# Altium schematic sheet M1-Test-Board.SchDoc: M1 Test Fixture Custom Board
size OrCAD B; Author: Leo Buchman; Revision: 1; SheetNumber: 1; SheetTotal: 2
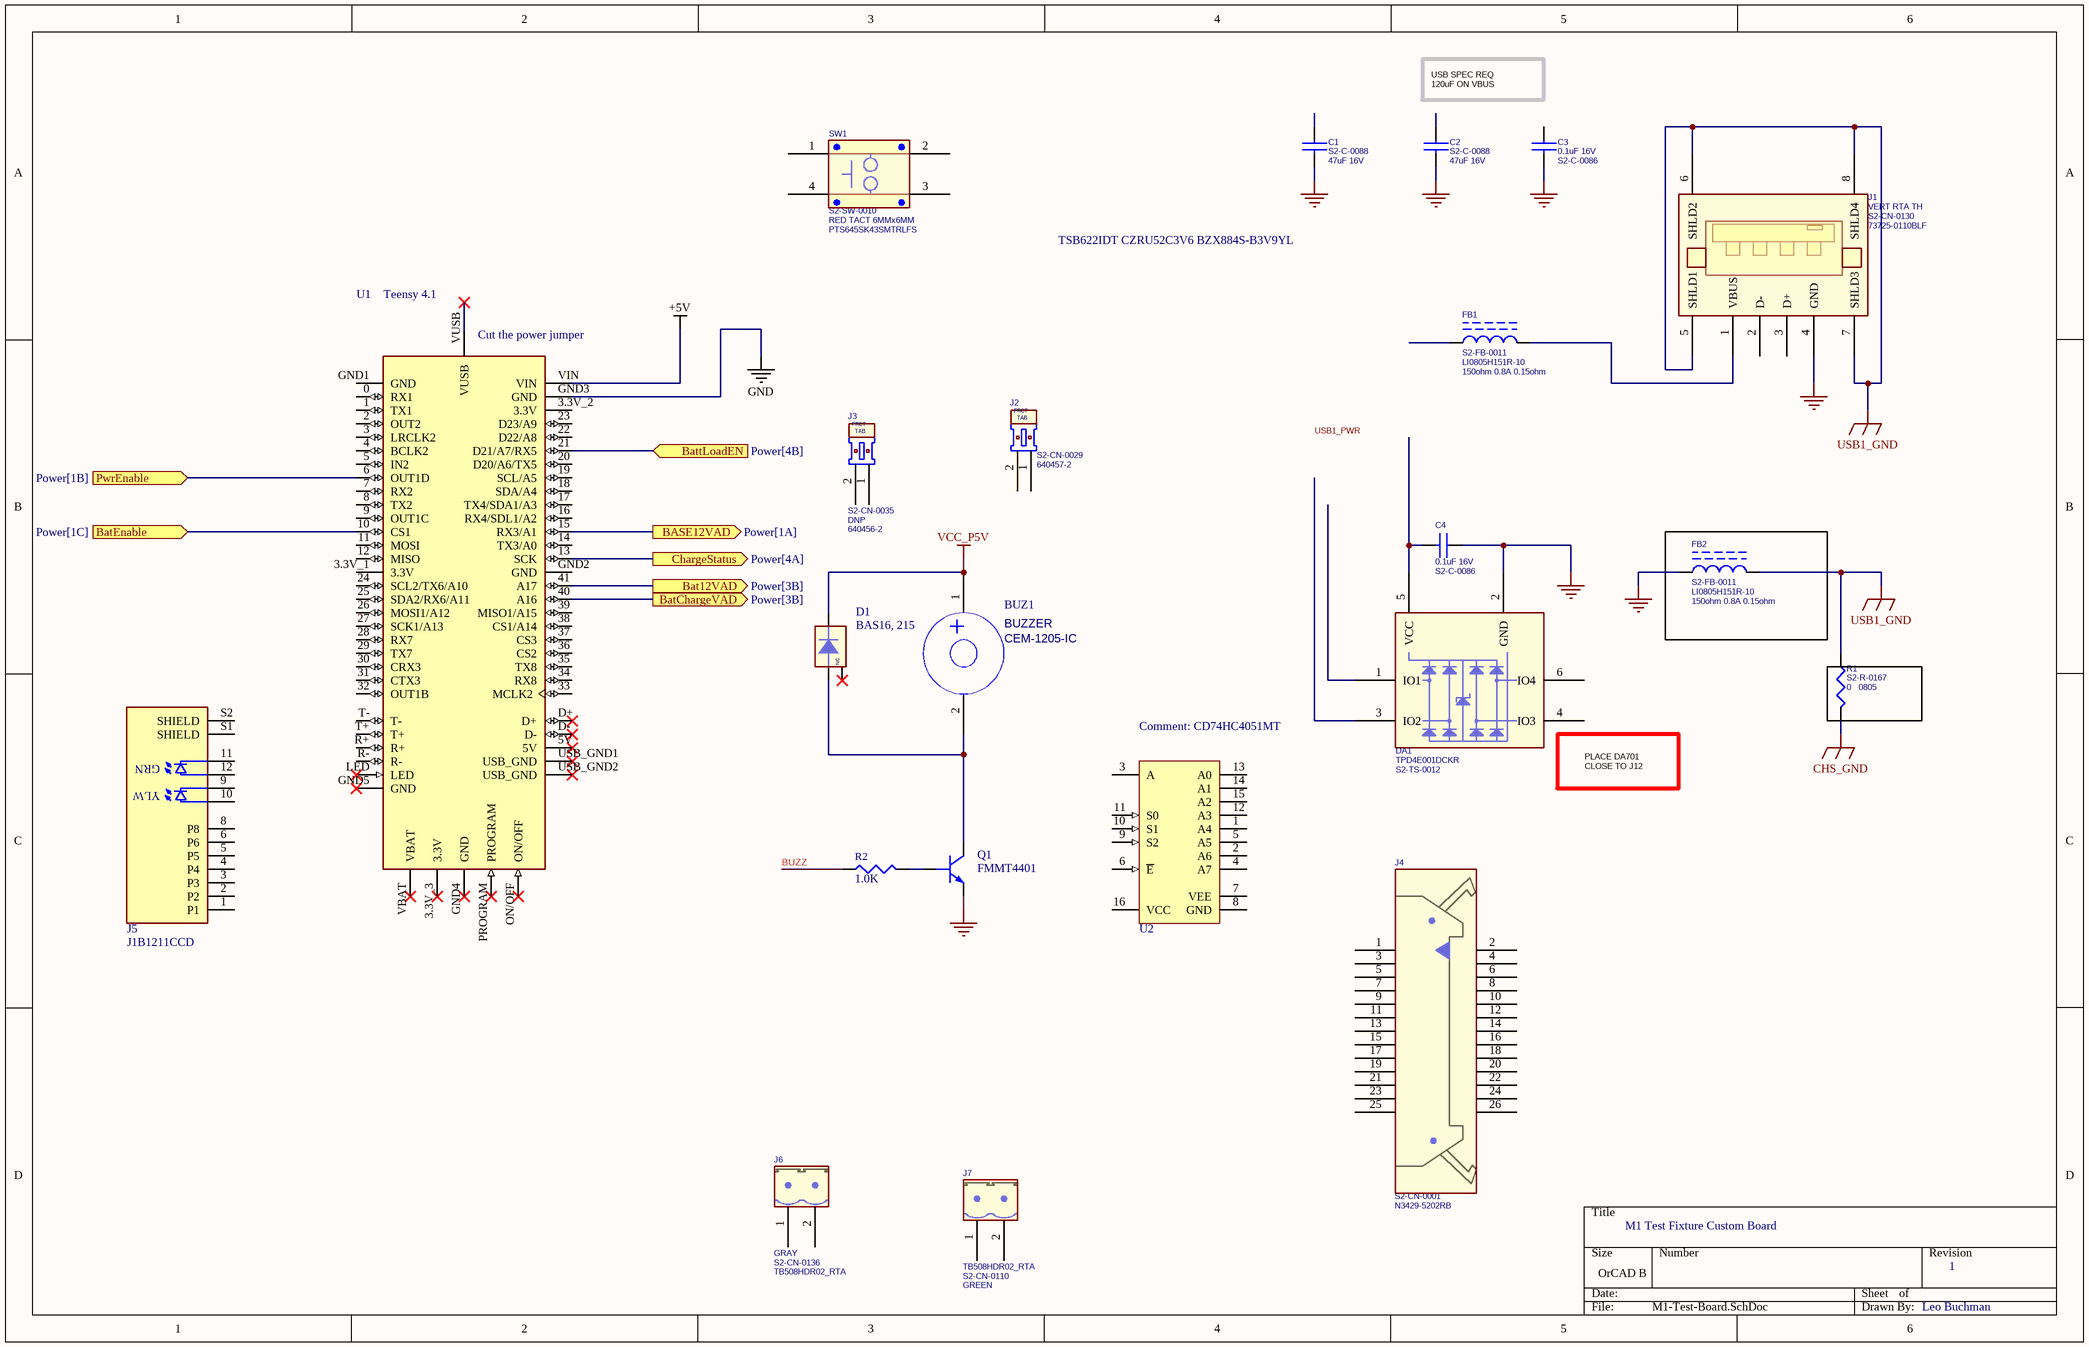
[diagram p0: M1-Test-Board.SchDoc]

## Parts
BUZ1  BUZZER  PACKAGE: CEM-1205-IC  [BUZZ-MB5120C]
C1  S2_PN: S2-C-0088  DESC: 47uF 16V  [CAPC3225X270N]  (hidden comment: C_47U_16V_1210)
C2  S2_PN: S2-C-0088  DESC: 47uF 16V  [CAPC3225X270N]  (hidden comment: C_47U_16V_1210)
C3  DESC: 0.1uF 16V  S2_PN: S2-C-0086  [CAPC1005X55N]  (hidden comment: C_0U1_16V_0402)
C4  DESC: 0.1uF 16V  S2_PN: S2-C-0086  [CAPC1005X55N]  (hidden comment: C_0U1_16V_0402)
D1  BAS16, 215  [SOT23-3]
DA1  DESC: TPD4E001DCKR  S2_PN: S2-TS-0012  [SOIC65Px210X110P-6N]  (hidden comment: DA_TPD4E001_ESD_QUAD)
FB1  S2_PN: S2-FB-0011  DESC: LI0805H151R-10  ATTR2: 150ohm 0.8A 0.15ohm  [FB0805]  (hidden comment: FB_0A8_150OHM_0805_DC_150mOHM)
FB2  S2_PN: S2-FB-0011  DESC: LI0805H151R-10  ATTR2: 150ohm 0.8A 0.15ohm  [FB0805]  (hidden comment: FB_0A8_150OHM_0805_DC_150mOHM)
J1  ATTR2: VERT RTA TH  S2_PN: S2-CN-0130  DESC: 73725-0110BLF  [CONN_73725-0110BLF]  (hidden comment: CN_USB_TYPE_A_RTA_VERT_TH)
J2  S2_PN: S2-CN-0029  DESC: 640457-2  [CONN_640457-2]  (hidden comment: CN_100_2POS_RTA_FRICT_LOCK)
J3  S2_PN: S2-CN-0035  DESC: 640456-2  [Conn_640456-2]  (hidden comment: CN_100_2POS_STR_FRICT_LOCK)
J4  S2_PN: S2-CN-0001  DESC: N3429-5202RB  [CONN_N3429-5202RB]  (hidden comment: CN_100_26POS_13x2_RTA_LATCH)
J5  J1B1211CCD  [RJ45-TH_J1B1211CCD-EasyEda]
J6  ATTR2: GRAY  S2_PN: S2-CN-0136  DESC: TB508HDR02_RTA  [Conn_5433668]  (hidden comment: CN_5MM08_02POS_HEADER_RTA_GRAY)
J7  DESC: TB508HDR02_RTA  S2_PN: S2-CN-0110  ATTR2: GREEN  [Conn_5442002]  (hidden comment: CN_5MM08_02POS_HEADER_RTA_GRN)
Q1  FMMT4401  [SOT23-3]
R1  S2_PN: S2-R-0167  DESC: 0   0805  [RESC2012X50N]  (hidden comment: R_0_0805)
R2  1.0K  [r0402]
SW1  S2_PN: S2-SW-0010  ATTR: RED TACT 6MMx6MM  DESC: PTS645SK43SMTRLFS  [SW_PTS645SK43SMTRLFS]  (hidden comment: SW_PTS645_SMT_RED)
U1  Teensy 4.1  [MODULE_DEV-16771]
U2  CD74HC4051MT  [D0016A_N]

## Ports
BASE12VAD (out, see Power[1A]), Bat12VAD (out, see Power[3B]), BatChargeVAD (out, see Power[3B]), BatEnable (in, see Power[1C]), BattLoadEN (in, see Power[4B]), ChargeStatus (out, see Power[4A]), PwrEnable (in, see Power[1B])

## Nets
+5V: U1.VIN
CHS_GND: R1.2
GND: C1.2 C2.2 C3.2 C4.1 DA1.2(GND) FB2.1 J1.4(GND) Q1.2(E) U1.GND3(GND)
USB1_GND: FB2.2 J1.5(SHLD1) J1.6(SHLD2) J1.7(SHLD3) J1.8(SHLD4) R1.1
VCC_P5V: BUZ1.1(POS) D1.3(C)
BASE12VAD: U1.15(RX3/A1) ; port BASE12VAD
Bat12VAD: U1.41(A17) ; port Bat12VAD
BatChargeVAD: U1.40(A16) ; port BatChargeVAD
BatEnable: U1.10(CS1) ; port BatEnable
BattLoadEN: U1.21(D21/A7/RX5) ; port BattLoadEN
BUZZ: R2.1
ChargeStatus: U1.13(SCK) ; port ChargeStatus
PwrEnable: U1.6(OUT1D) ; port PwrEnable
NetBUZ1_2: BUZ1.2(NEG) D1.1(A) Q1.1(C)
NetC4_2: C4.2 DA1.5(VCC)
NetFB1_2: FB1.2 J1.1(VBUS)
NetQ1_3: Q1.3(B) R2.2

Not connected (* = marked no-connect by the designer): C1 1; C2 1; C3 1; D1 2(NC)*; DA1 1(IO1) 3(IO2) 4(IO3) 6(IO4); FB1 1; J1 2(D-) 3(D+); J2 1 2; J3 1 2; J4 1 2 3 4 5 6 7 8 9 10 11 12 13 14 15 16 17 18 19 20 21 22 23 24 25 26; J5 1(P1) 2(P2) 3(P3) 4(P4) 5(P5) 6(P6) 8(P8) 9(YA) 10(YK) 11(GA) 12(GK) S1(SHIELD) S2(SHIELD); J6 1 2; J7 1 2; SW1 1 2 3 4; U1 0(RX1) 1(TX1) 2(OUT2) 3(LRCLK2) 3.3V_1(3.3V) 3.3V_2(3.3V) 3.3V_3(3.3V)* 4(BCLK2) 5(IN2) 5V* 7(RX2) 8(TX2) 9(OUT1C) 11(MOSI) 12(MISO) 14(TX3/A0) 16(RX4/SDL1/A2) 17(TX4/SDA1/A3) 18(SDA/A4) 19(SCL/A5) 20(D20/A6/TX5) 22(D22/A8) 23(D23/A9) 24(SCL2/TX6/A10) 25(SDA2/RX6/A11) 26(MOSI1/A12) 27(SCK1/A13) 28(RX7) 29(TX7) 30(CRX3) 31(CTX3) 32(OUT1B) 33(MCLK2) 34(RX8) 35(TX8) 36(CS2) 37(CS3) 38(CS1/A14) 39(MISO1/A15) D+* D-* GND1(GND) GND2(GND) GND4(GND)* GND5(GND)* LED* ON/OFF* PROGRAM* R+ R- T+ T- USB_GND1(USB_GND)* USB_GND2(USB_GND)* VBAT* VUSB*; U2 1(A4) 2(A6) 3(A) 4(A7) 5(A5) 6(~{E}) 7(VEE) 8(GND) 9(S2) 10(S1) 11(S0) 12(A3) 13(A0) 14(A1) 15(A2) 16(VCC)

## Notes on the sheet
- USB SPEC REQ
  120uF ON VBUS
- TSB622IDT CZRU52C3V6 BZX884S-B3V9YL
- (near U1) Cut the power jumper
- (near DA1) PLACE DA701
  CLOSE TO J12
- Labels drawn without touching a wire or pin: USB1_PWR
- (in symbol CN_100_2POS_RTA_FRICT_LOCK) FRCT; TAB
- (in symbol CN_100_2POS_STR_FRICT_LOCK) FRCT; TAB
- (in symbol CON-0002) GRN; YLW

## Library data of the parts
BUZ1 = S2-BZ-0001: BUZZER MAGNETIC INDICATOR, INTERNAL DRIVE 2.3KHz 12MM DIAMETER 7.6MM LEAD SPACING; ADI Part Number: 3716-0001; Voltage: 5V; Current: 35mA; CLASS: DISCRETE; COMPSIDE: TOP; COMPLOC: [1301.000,1659.000]; COMPROT: 180; COMPGROUP: 0; COMPFIXED: NO; COMPHEIGHT: 0.000; S2 PN: S2-BZ-0001; COMPLOCKED: NO; COMPKEY: NO; DECOUPLER: NO; JLCPCB_PART: NA; S2PN: S2-BZ-0001; PCB Footprint: BUZZ-MB5120C
C1 C2 = C_47U_16V_1210: PKG: CC1210IPC; ATTR: X5R 20%
C3 C4 = C_0U1_16V_0402: ATTR: X7R 10%; PKG: CC0402IPC
D1 = S2-D-0024: DIODE SWITCHING 500nA REVERSE LEAKAGE SOT-23-3; PKG: SOT-23-3; ATTR: DIODE SWITCHING 500NA REVERSE LEAKAGE SOT-23-3; JLCPCB_PART: C79997; S2 PN: S2-D-0024
DA1 = DA_TPD4E001_ESD_QUAD: ATTR: ESD PROTECTION QUAD LOW VOLT LOW VAP; PKG: SC-70-6
FB1 FB2 = FB_0A8_150OHM_0805_DC_150mOHM: ATTR: FERRITE 800MA 150 OHM 0805, 0.15 OHM DC; PKG: CC0805IPC
J1 = CN_USB_TYPE_A_RTA_VERT_TH: PKG: USB_A_RCPT_TH_RTA_VERT; ATTR: CONN USB RCPT TYPE A VERT TH RTA
J2 = CN_100_2POS_RTA_FRICT_LOCK: ATTR: HEADER MALE 2POS 0.100" RTA FRICTION LOCK; PKG: 640457-2
J3 = CN_100_2POS_STR_FRICT_LOCK: ATTR: HEADER MALE 2POS 0.100" STR FRICTION LOCK; DNP: DNP; PKG: 640456-2
J4 = CN_100_26POS_13x2_RTA_LATCH: ATTR: CONN HEADER LATCH/EJEC  RTA DUAL ROW 26POS; PKG: 2M54_13x2_TH_LATCH
J5 = CON-0002: Single RJ45 Connector Module with 10/100 BASE; Manufacturer: WIZnet; Direction: Down; Number of Ports: 1; Number of Cores per Jack: 4; Shielding: Shielded; Number of Positions: 6; Pitch: 0.1inch; Current Rating: 3A; Voltage Rating: 250V; Gender: Male; Part Name: CON-0002; Supplier 1: Digi-Key; Supplier Part Number 1: J1B1211CCD-ND; Manufacturer Part Number: J1B1211CCD; RoHS: Yes; LCSC Part Number: C910371; Category: Modular / Ethernet Connectors; Mount: Through Hole; Color: Green,Yellow; Contact Material: Brass; Contact Plating: Gold; Housing Material: Thermoplastic; Min Operating Temperature: -40°C; Max Operating Temperature: 85°C; Connector Type: RJ45; Packaging: Bulk; Number of Rows: 1; Termination: Solder; ComponentLink1URL: http://wizwiki.net/wiki/lib/exe/fetch.php?med; ComponentLink1Description: http://wizwiki.net/wiki/lib/exe/fetch.php?med; Series: WR-PHD; Contact Type: Male Pin; Contact Mating Length: 0.236inch; RoHS Compliant: Yes; Contact Gender: Male; Number of Contacts: 6; REACH SVHC: Unknown; Lead Free: Lead Free; ComponentLink2URL: http://www.mouser.com/ds/2/445/6130xx11121-53; ComponentLink2Description: http://www.mouser.com/ds/2/445/6130xx11121-53; ComponentLink3URL: http://www.farnell.com/cad/1737268.pdf?src-su; ComponentLink3Description: http://www.farnell.com/cad/1737268.pdf?src-su; ComponentLink4URL: https://katalog.we-online.de/em/datasheet/613; ComponentLink4Description: https://katalog.we-online.de/em/datasheet/613
J6 = CN_5MM08_02POS_HEADER_RTA_GRAY: ATTR: HEADER TERM BLK 5.08MM 2POS RTA GRAY; PKG: TB508HDR02_RTA
J7 = CN_5MM08_02POS_HEADER_RTA_GRN: ATTR: HEADER TERM BLK 5.08MM 2POS RTA GREEN; PKG: TB508HDR02_RTA
Q1 = S2-Q-0005: TRANSISTOR NPN GEN PUR SOT-23; S2 PN: S2-Q-0005; PCB Footprint: SOT23-3; JLCPCB_PART: C20526
R1 = R_0_0805: PKG: CC0805IPC; ATTR: 1/10W 50mohm MAX
R2 = S2-R-0157: RES 1K OHM 1/16W 1% 0402; S2 PN: S2-R-0023; JLCPCB_PART: C21190
SW1 = SW_PTS645_SMT_RED: ATTR2: SWITCH SMT RED 6MMx6MM; PKG: PTS645_SMT
U1 = Mod-0001: RT1062 Teensy 4.1 series ARM® Cortex®-M7 MPU; Manufacturer: SparkFun; Manufacturer Part Number: 16771; Part Name: Mod-0001; Supplier 1: Digi-Key; Supplier Part Number 1: 1568-DEV-16771-ND; RoHS: Yes; Category: Embedded Processors and Controllers; Stock 1: 1896; Pricing 1: 1=29.38000 (USD)
U2 = CMP-1575-00038-4: High Speed CMOS 8-Channel Analog Multiplexer/Demultiplexer, D0016A, SMALL T&R; Manufacturer: Texas Instruments; VCC(Max)(V): 6; Ron(Typ)(Ohms): 45; Rating: Catalog; VCC(Min)(V): 2; Ron(Max)(Ohms): 130; Configuration: 1 X 1：8 MUX; Crosstalk: Yes; Bandwidth(Max)(MHz): 180; PackageVersion: http://www.ti.com/lit/ml/mpds178g/mpds178g.pdf; Output Type: CMOS; Generic Part Number: CD74HC4051; PackageReference: D0016A; Operating Temperature Range(C): -55 to 125; DatasheetVersion: SCHS122J; Code_JEDEC: MS-012 variation AC